# Altium schematic sheet X-DO10 RFID_LED_V1.0(1).SchDoc
size A4
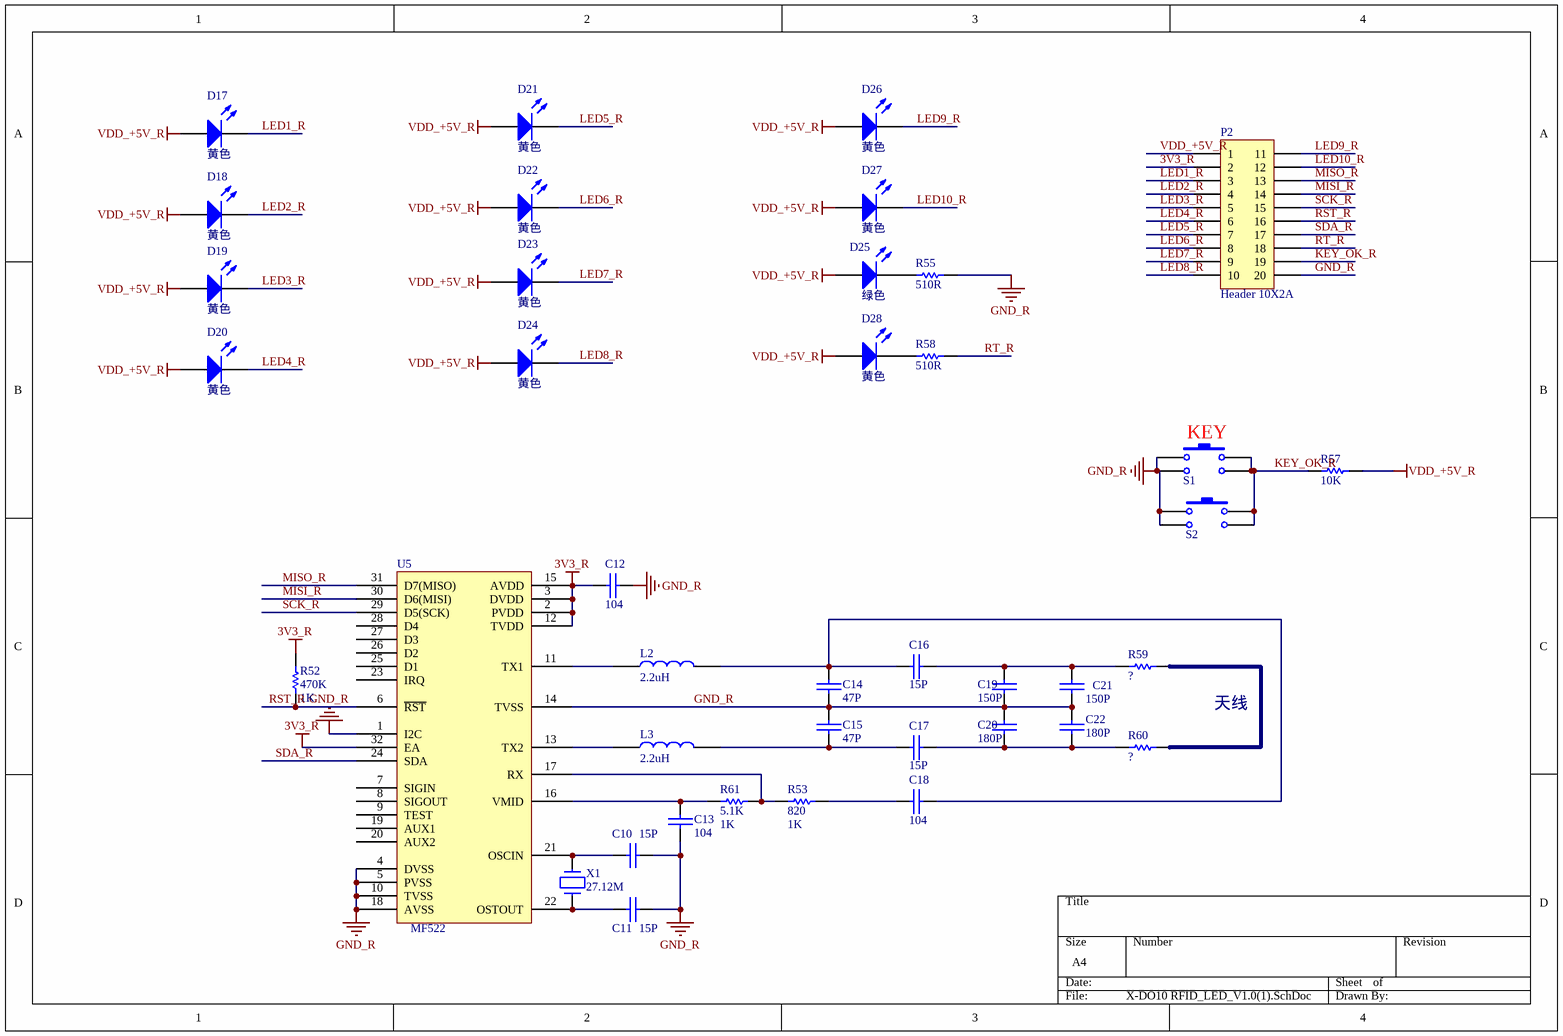
[diagram p0: X-DO10 RFID_LED_V1.0(1).SchDoc]

## Parts
C10  15P  [c0603]
C11  15P  [c0603]
C12  104  [c0603]
C13  104  [c0603]
C14  47P  [c0603]
C15  47P  [c0603]
C16  15P  [c0603]
C17  15P  [c0603]
C18  104  [c0603]
C19  150P  [c0603]
C20  180P  [c0603]
C21  150P  [c0603]
C22  180P  [c0603]
D17  黄色  [LED-2.54-3]
D18  黄色  [LED-2.54-3]
D19  黄色  [LED-2.54-3]
D20  黄色  [LED-2.54-3]
D21  黄色  [LED-2.54-3]
D22  黄色  [LED-2.54-3]
D23  黄色  [LED-2.54-3]
D24  黄色  [LED-2.54-3]
D25  红色  [LED-2.54-3]  (value not drawn)
D26  黄色  [LED-2.54-3]
D27  黄色  [LED-2.54-3]
D28  红色  [LED-2.54-3]  (value not drawn)
L2  2.2uH  [r0805]
L3  2.2uH  [r0805]
P2  Header 10X2A  [SMT2.0  2*10]
R52  470K  value 1K  [R0603]
R53  820  value 1K  [r0603]
R55  贴片电阻  [R0603]  (value not drawn)
R57  (no value)  [R0603]
R58  (no value)  [R0603]
R59  ?  [R0805]
R60  ?  [R0805]
R61  5.1K  value 1K  [r0603]
S1  TS1102W  [TS1102W]  (value not drawn)
S2  TS1102W  [TS1102W]  (value not drawn)
U5  MF522  [QFN50P500X500X100-32N]
X1  27.12M  [49US]

## Nets
3V3_R: C12.1 P2.2 R52.2 U5.2(PVDD) U5.3(DVDD) U5.12(TVDD) U5.15(AVDD) U5.32(EA)
GND_R: C10.2 C11.2 C12.2 C13.2 C14.1 C15.1 C19.2 C20.1 C21.2 C22.1 P2.20 R55.1 S1.1 S1.3 S2.1 S2.3 U5.1(I2C) U5.4(DVSS) U5.5(PVSS) U5.10(TVSS) U5.14(TVSS) U5.18(AVSS)
VDD_+5V_R: D17.1(A) D18.1(A) D19.1(A) D20.1(A) D21.1(A) D22.1(A) D23.1(A) D24.1(A) D25.1(A) D26.1(A) D27.1(A) D28.1(A) P2.1 R57.1
KEY_OK_R: P2.19 R57.2 S1.2 S1.4 S2.2 S2.4
LED1_R: D17.2(K) P2.3
LED2_R: D18.2(K) P2.4
LED3_R: D19.2(K) P2.5
LED4_R: D20.2(K) P2.6
LED5_R: D21.2(K) P2.7
LED6_R: D22.2(K) P2.8
LED7_R: D23.2(K) P2.9
LED8_R: D24.2(K) P2.10
LED9_R: D26.2(K) P2.11
LED10_R: D27.2(K) P2.12
MISI_R: P2.14 U5.30(D6(MISI))
MISO_R: P2.13 U5.31(D7(MISO))
RST_R: P2.16 R52.1 U5.6(~{RST})
RT_R: P2.18 R58.1
SCK_R: P2.15 U5.29(D5(SCK))
SDA_R: P2.17 U5.24(SDA)
NetC10_1: C10.1 U5.21(OSCIN) X1.2
NetC11_1: C11.1 U5.22(OSTOUT) X1.1
NetC13_1: C13.1 R61.1 U5.16(VMID)
NetC14_2: C14.2 C16.2 C18.2 L2.2
NetC15_2: C15.2 C17.2 L3.2
NetC16_1: C16.1 C19.1 C21.1 R59.1
NetC17_1: C17.1 C20.2 C22.2 R60.1
NetC18_1: C18.1 R53.2
NetD25_2: D25.2(K) R55.2
NetD28_2: D28.2(K) R58.2
NetL2_1: L2.1 U5.11(TX1)
NetL3_1: L3.1 U5.13(TX2)
NetR53_1: R53.1 R61.2 U5.17(RX)
NetR59_2: R59.2 R60.2

Not connected (* = marked no-connect by the designer): U5 7(SIGIN) 8(SIGOUT) 9(TEST) 19(AUX1) 20(AUX2) 23(IRQ) 25(D1) 26(D2) 27(D3) 28(D4)

## Notes on the sheet
- (near S1) KEY
- 天线
- (in symbol LED0) 黄色; 绿色
- (in symbol Res Semi) 10K; 510R

## Library data of the parts
C10-C22 = CAP: Capacitor
D17-D28 = LED0: Typical INFRARED GaAs LED
L2 L3 = INDUCTOR1
P2 = Header 10X2A: Header, 10-Pin, Dual row; LatestRevisionDate: 17-Jul-2002; LatestRevisionNote: Re-released for DXP Platform.; Publisher: Altium Limited
R52 R53 R55 R57-R61 = Res Semi: Semiconductor Resistor
  R52 R53 R59-R61: Published: 8-Jun-2000; LatestRevisionDate: 17-Jul-2002; LatestRevisionNote: Re-released for DXP Platform.; PackageReference: AXIAL-0.5; Publisher: Altium Limited
U5 = MF522B
X1 = Tm08B.S01_12M_42